# EAGLE schematic ir array (EAGLE 8.5.1)
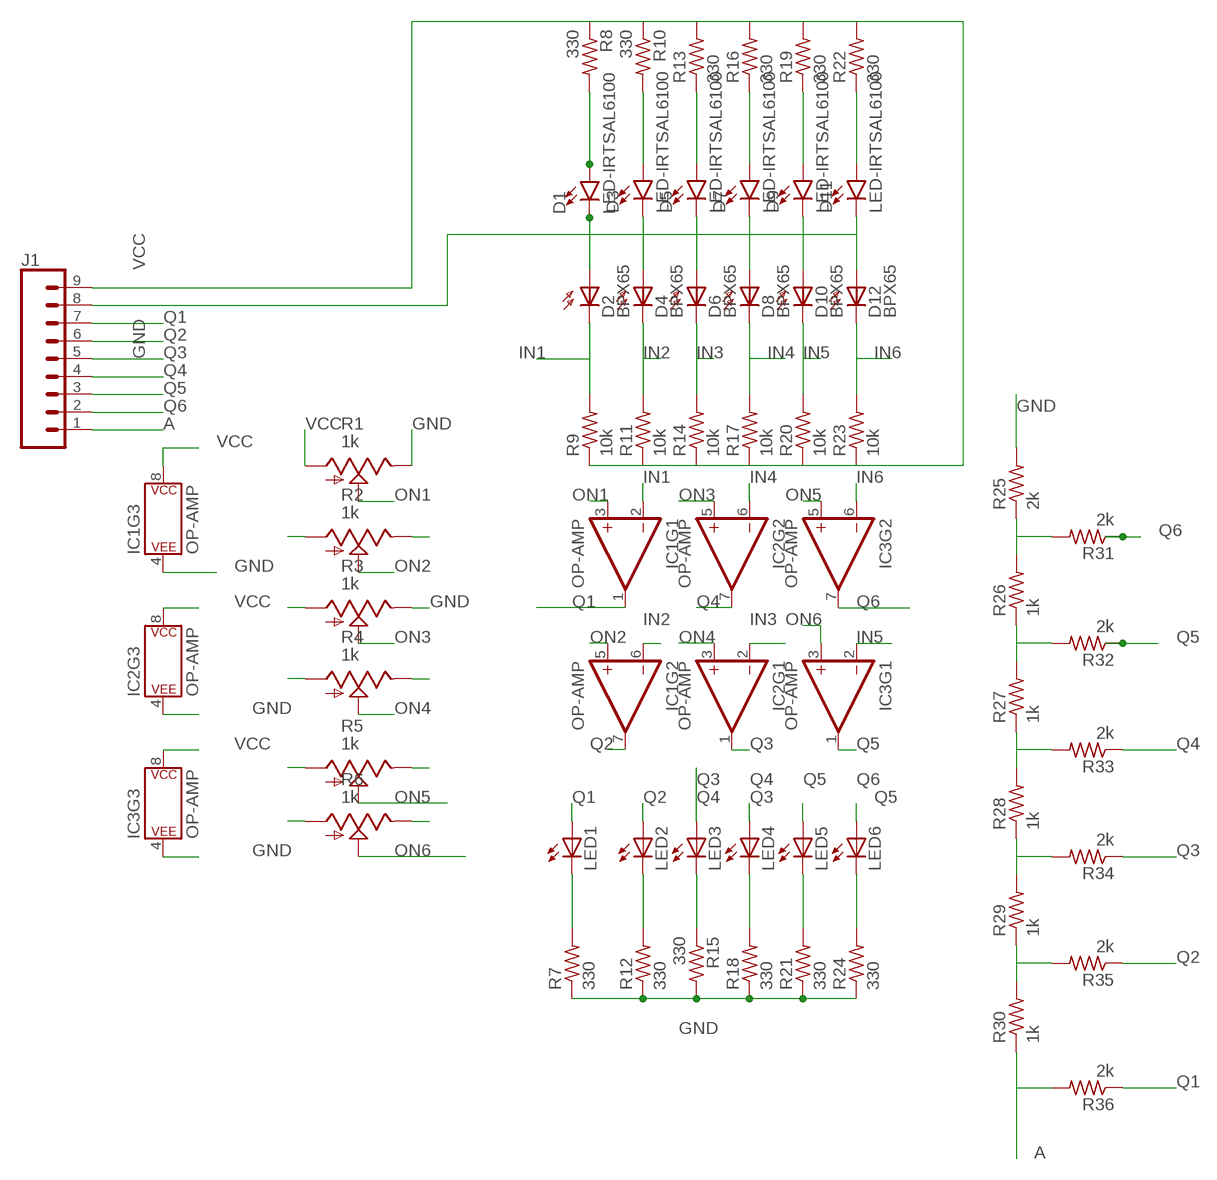
[diagram p0: schematic, sheet 1]

## Parts
D1  LED-IRTSAL6100  [LED_5MM]
D2  BPX65  [BPX65]
D3  LED-IRTSAL6100  [LED_5MM]
D4  BPX65  [BPX65]
D5  LED-IRTSAL6100  [LED_5MM]
D6  BPX65  [BPX65]
D7  LED-IRTSAL6100  [LED_5MM]
D8  BPX65  [BPX65]
D9  LED-IRTSAL6100  [LED_5MM]
D10  BPX65  [BPX65]
D11  LED-IRTSAL6100  [LED_5MM]
D12  BPX65  [BPX65]
IC1  OP-AMP  OPAMP-DUALDIP  [DIP08]
IC2  OP-AMP  OPAMP-DUALDIP  [DIP08]
IC3  OP-AMP  OPAMP-DUALDIP  [DIP08]
J1  CONN_09  [1X09]
LED1  LED3MM  [LED3MM]
LED2  LED3MM  [LED3MM]
LED3  LED3MM  [LED3MM]
LED4  LED3MM  [LED3MM]
LED5  LED3MM  [LED3MM]
LED6  LED3MM  [LED3MM]
R1  1k  TRIM_US-B25P  [B25P]
R2  1k  TRIM_US-B25P  [B25P]
R3  1k  TRIM_US-B25P  [B25P]
R4  1k  TRIM_US-B25P  [B25P]
R5  1k  TRIM_US-B25P  [B25P]
R6  1k  TRIM_US-B25P  [B25P]
R7  330  R-US_0207/9  [0207/9]
R8  330  R-US_0207/9  [0207/9]
R9  10k  R-US_0207/9  [0207/9]
R10  330  R-US_0207/9  [0207/9]
R11  10k  R-US_0207/9  [0207/9]
R12  330  R-US_0207/9  [0207/9]
R13  330  R-US_0207/9  [0207/9]
R14  10k  R-US_0207/9  [0207/9]
R15  330  R-US_0207/9  [0207/9]
R16  330  R-US_0207/9  [0207/9]
R17  10k  R-US_0207/9  [0207/9]
R18  330  R-US_0207/9  [0207/9]
R19  330  R-US_0207/9  [0207/9]
R20  10k  R-US_0207/9  [0207/9]
R21  330  R-US_0207/9  [0207/9]
R22  330  R-US_0207/9  [0207/9]
R23  10k  R-US_0207/9  [0207/9]
R24  330  R-US_0207/9  [0207/9]
R25  2k  R-US_0207/9  [0207/9]
R26  1k  R-US_0207/9  [0207/9]
R27  1k  R-US_0207/9  [0207/9]
R28  1k  R-US_0207/9  [0207/9]
R29  1k  R-US_0207/9  [0207/9]
R30  1k  R-US_0207/9  [0207/9]
R31  2k  R-US_0207/9  [0207/9]
R32  2k  R-US_0207/9  [0207/9]
R33  2k  R-US_0207/9  [0207/9]
R34  2k  R-US_0207/9  [0207/9]
R35  2k  R-US_0207/9  [0207/9]
R36  2k  R-US_0207/9  [0207/9]

## Nets
A: J1.1 R30.1 R36.2
GND: D1.K(C) D2.A D3.K(C) D4.A D5.K(C) D6.A D7.K(C) D8.A D9.K(C) D10.A D11.K(C) D12.A IC1.4(P$V-) IC2.4(P$V-) IC3.4(P$V-) J1.8 R1.E R2.E R3.E R4.E R5.E R6.E R7.1 R12.1 R15.2 R18.1 R21.1 R24.1 R25.2
IN1: D2.K(C) IC1.2(-IN) R9.2
IN2: D4.K(C) IC1.6(-IN) R11.2
IN3: D6.K(C) IC2.2(-IN) R14.2
IN4: D8.K(C) IC2.6(-IN) R17.2
IN5: D10.K(C) IC3.2(-IN) R20.2
IN6: D12.K(C) IC3.6(-IN) R23.2
N$8: D1.A R8.2
N$9: D3.A R10.2
N$10: D5.A R13.1
N$11: D7.A R16.1
N$12: D9.A R19.1
N$13: D11.A R22.1
N$19: LED1.K(C) R7.2
N$20: LED2.K(C) R12.2
N$21: LED3.K(C) R15.1
N$22: LED4.K(C) R18.2
N$23: LED5.K(C) R21.2
N$24: LED6.K(C) R24.2
N$25: R25.1 R26.2 R31.2
N$26: R26.1 R27.2 R32.2
N$27: R27.1 R28.2 R33.2
N$28: R28.1 R29.2 R34.2
N$29: R29.1 R30.2 R35.2
ON1: IC1.3(+IN) R1.S
ON2: IC1.5(+IN) R2.S
ON3: IC2.5(+IN) R3.S
ON4: IC2.3(+IN) R4.S
ON5: IC3.5(+IN) R5.S
ON6: IC3.3(+IN) R6.S
Q1: IC1.1(OUT) J1.7 LED1.A R36.1
Q2: IC1.7(OUT) J1.6 LED2.A R35.1
Q3: IC2.1(OUT) J1.5 LED3.A R34.1
Q4: IC2.7(OUT) J1.4 LED4.A R33.1
Q5: IC3.1(OUT) J1.3 LED5.A R32.1
Q6: IC3.7(OUT) J1.2 LED6.A R31.1
VCC [available]: IC1.8(P$V+) IC2.8(P$V+) IC3.8(P$V+) J1.9 R1.A R2.A R3.A R4.A R5.A R6.A R8.1 R9.1 R10.1 R11.1 R13.2 R14.1 R16.2 R17.1 R19.2 R20.1 R22.2 R23.1

## Library data of the parts
D1 D3 D5 D7 D9 D11 = SparkFun-LED:LED-IR: Infrared LED (IR) Wavelength: 940nm Packages: TSAL6100 LTE302 - Side firing. Check SparkFun-Sensors.lbr for the receiver SparkFun Products: ZX Distance and Gesture Sensor <[https://www.sparkfun.com/products/12780]> Infrared Emitters and Detectors <https://www.sparkfun.com/products/241>; PROD_ID: DIO-12058
D2 D4 D6 D8 D10 D12 = opto-trans-siemens:BPX65: PHOTO DIODE; MPN: BPX65.; OC_FARNELL: 327451; OC_NEWARK: 06WX2764
IC1-IC3 = SparkFun-IC-Amplifiers:OPAMP-DUAL: Generic op-amp footprint This component is for the standard 358 pinning of a dual op-amp From the LM358 datasheet: Pin 1: Output A Pin 2: Inverting Input A Pin 3: Non-Inverting Input A Pin 4: Gnd Pin 5: Non-Inverting Input B Pin 6: Inverting Input B Pin 7: Output B Pin 8: V+; PROD_ID: NA-XXXXX
J1 = SparkFun-Connectors:CONN_09: Multi connection point. Often used as Generic Header-pin footprint for 0.1 inch spaced/style header connections On any of the 0.1 inch spaced packages, you can populate with these: Break Away Headers - Straight <https://www.sparkfun.com/products/116> (PRT-00116) Break Away Male Headers - Right Angle <https://www.sparkfun.com/products/553> (PRT-00553) Female Headers <https://www.sparkfun.com/products/115> (PRT-00115) Break Away Headers - Machine Pin <https://www.sparkfun.com/products/117> (PRT-00117) Break Away Female Headers - Swiss Machine Pin <https://www.sparkfun.com/products/743> (PRT-00743) For SCREWTERMINALS and SPRING TERMINALS visit here: Screw Terimnals on SparkFun.com <https://www.sparkfun.com/search/results?term=Screw+Terminals> (5mm/3.5mm/2.54mm spacing) This device is also useful as a general connection point to wire up your design to another part of your project. Our various solder wires solder well into these plated through hole pads. Hook-Up Wire - Assortment (Stranded, 22 AWG) <https://www.sparkfun.com/products/11375> (PRT-11375) Hook-Up Wire - Assortment (Solid Core, 22 AWG) <https://www.sparkfun.com/products/11367> (PRT-11367) View the entire wire category on our website here <https://www.sparkfun.com/categories/141> Special notes: Molex polarized connector foot print use with SKU : PRT-08231 with associated crimp pins and housings. 1MM SMD Version SKU: PRT-10208 NOTES ON THE VARIANTS LOCK and LOCK_LONGPADS... This footprint was designed to help hold the alignment of a through-hole component (i.e. 6-pin header) while soldering it into place. You may notice that each hole has been shifted either up or down by 0.005 of an inch from it's more standard position (which is a perfectly straight line). This slight alteration caused the pins (the squares in the middle) to touch the edges of the holes. Because they are alternating, it causes a "brace" to hold the component in place. 0.005 has proven to be the perfect amount of "off-center" position when using our standard breakaway headers. Although looks a little odd when you look at the bare footprint, once you have a header in there, the alteration is very hard to notice. Also,if you push a header all the way into place, it is covered up entirely on the bottom side.
LED1-LED6 = adafruit:LED: LED OSRAM: - CHIPLED LG R971, LG N971, LY N971, LG Q971, LY Q971, LO R971, LY R971 LH N974, LH R974 LS Q976, LO Q976, LY Q976 LO Q996 - Hyper CHIPLED LW Q18S LB Q993, LB Q99A, LB R99A - SideLED LS A670, LO A670, LY A670, LG A670, LP A670 LB A673, LV A673, LT A673, LW A673 LH A674 LY A675 LS A676, LA A676, LO A676, LY A676, LW A676 LS A679, LY A679, LG A679 - Hyper Micro SIDELED® LS Y876, LA Y876, LO Y876, LY Y876 LT Y87S - SmartLED LW L88C, LW L88S LB L89C, LB L89S, LG L890 LS L89K, LO L89K, LY L89K LS L896, LA L896, LO L896, LY L896 - TOPLED LS T670, LO T670, LY T670, LG T670, LP T670 LSG T670, LSP T670, LSY T670, LOP T670, LYG T670 LG T671, LOG T671, LSG T671 LB T673, LV T673, LT T673, LW T673 LH T674 LS T676, LA T676, LO T676, LY T676, LB T676, LH T676, LSB T676, LW T676 LB T67C, LV T67C, LT T67C, LS T67K, LO T67K, LY T67K, LW E67C LS E67B, LA E67B, LO E67B, LY E67B, LB E67C, LV E67C, LT E67C LW T67C LS T679, LY T679, LG T679 LS T770, LO T770, LY T770, LG T770, LP T770 LB T773, LV T773, LT T773, LW T773 LH T774 LS E675, LA E675, LY E675, LS T675 LS T776, LA T776, LO T776, LY T776, LB T776 LHGB T686 LT T68C, LB T68C - Hyper Mini TOPLED® LB M676 - Mini TOPLED Santana® LG M470 LS M47K, LO M47K, LY M47K Source: http://www.osram.convergy.de/
R1-R6 = pot:TRIM_US-: POTENTIOMETER
R7-R36 = adafruit:R-US_: RESISTOR, American symbol

## Net classes
1 available: width 0.203 mm, drill 0.152 mm, clearance 0.152 mm